# EAGLE schematic base-module-r1 (EAGLE 5.12)

## Sheet 1 of 4
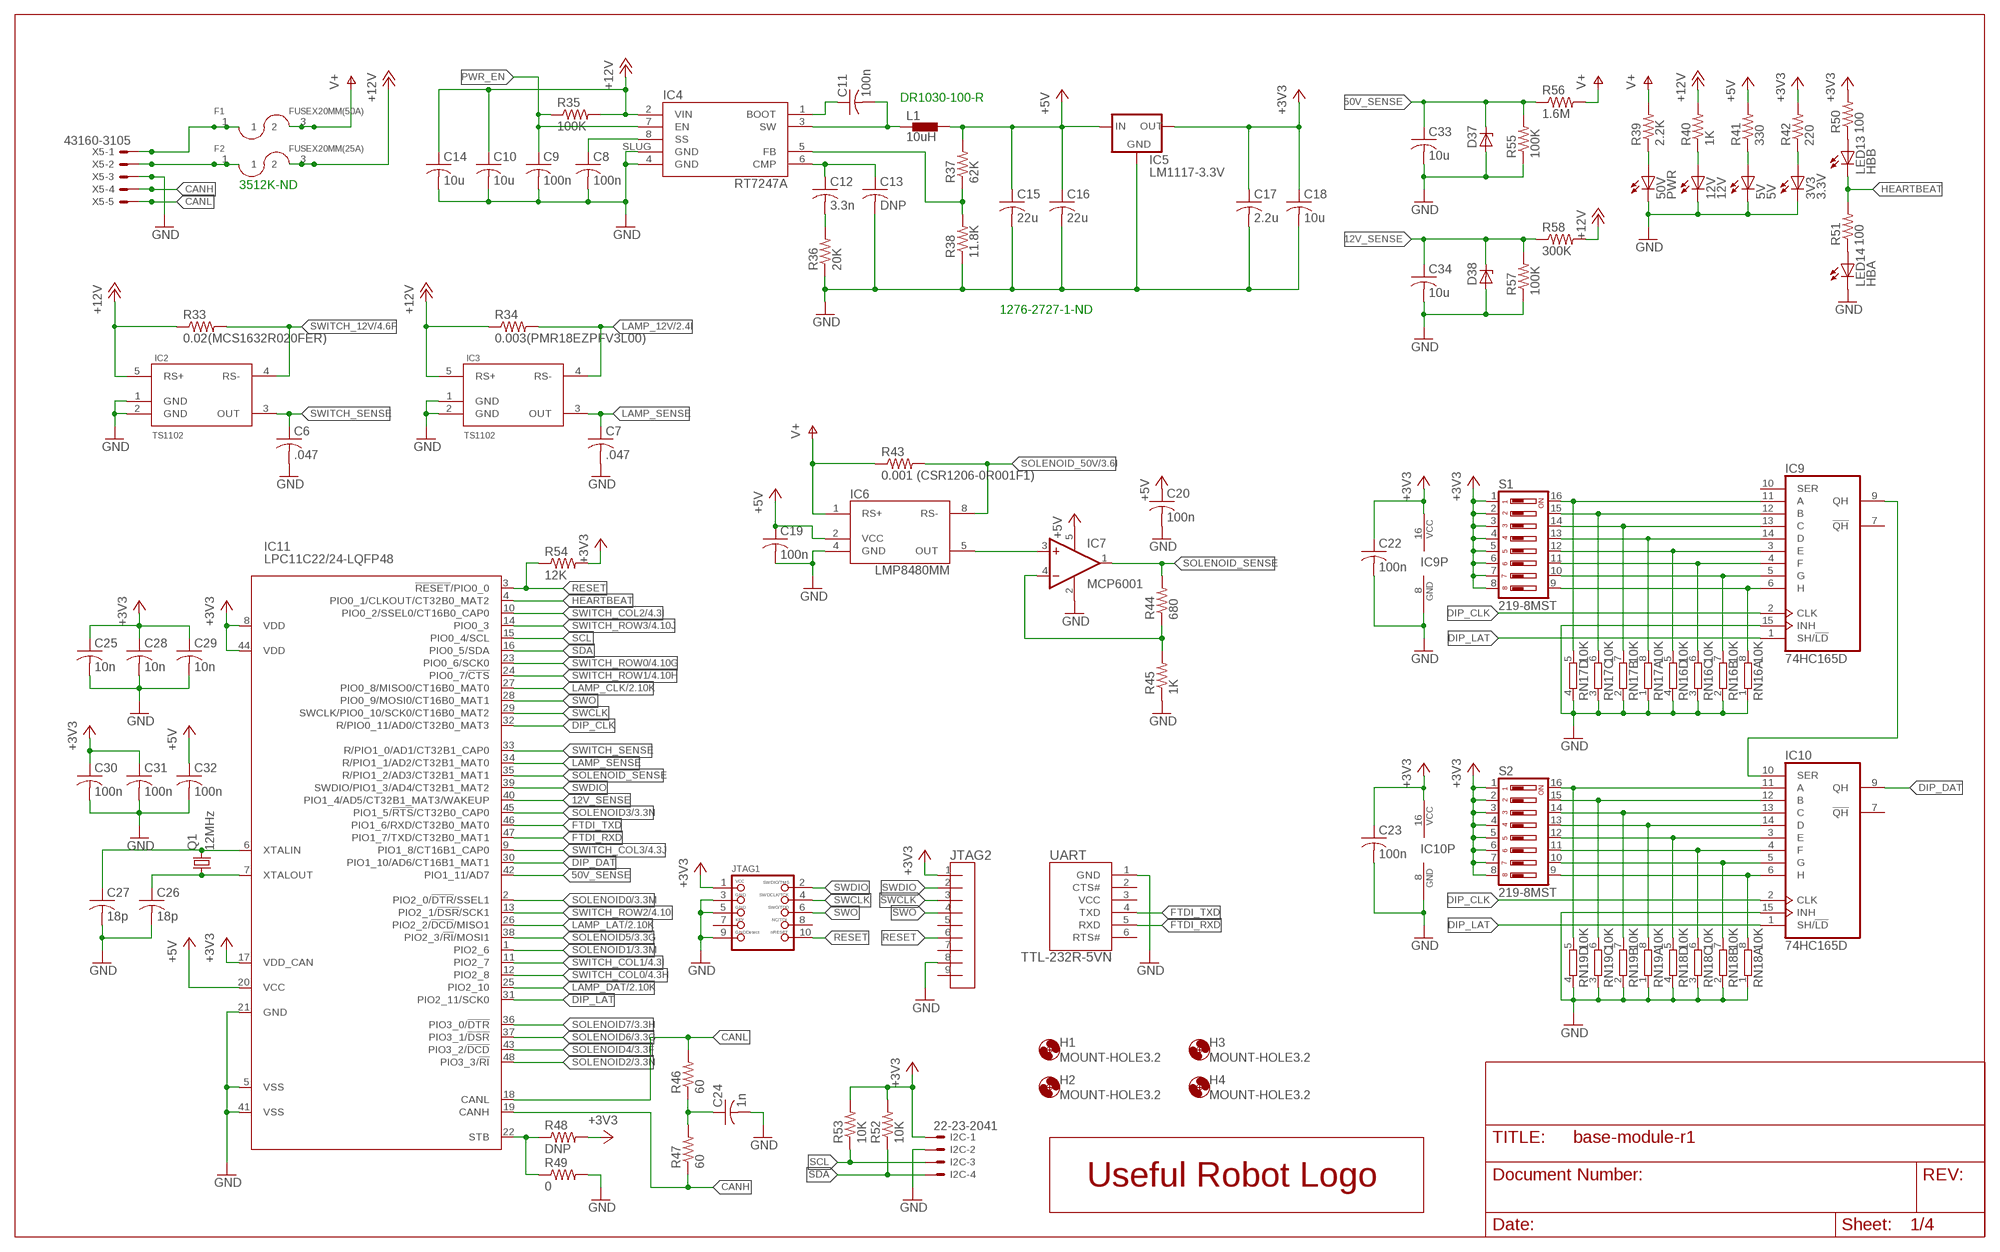
[diagram p0: schematic, sheet 1]

### Parts
3V3  3.3V  LEDCHIP-LED0805  [CHIP-LED0805]
5V  5V  LEDCHIP-LED0805  [CHIP-LED0805]
12V  12V  LEDCHIP-LED0805  [CHIP-LED0805]
50V  PWR  LEDCHIP-LED0805  [CHIP-LED0805]
C6  .047  C-USC0603  [C0603]
C7  .047  C-USC0603  [C0603]
C8  100n  C-USC0805  [C0805]
C9  100n  C-USC0805  [C0805]
C10  10u  C-USC1206  [C1206]
C11  100n  C-USC0805  [C0805]
C12  3.3n  C-USC0805  [C0805]
C13  DNP  C-USC0805  [C0805]
C14  10u  C-USC1206  [C1206]
C15  22u  C-USC1206  [C1206]
C16  22u  C-USC1206  [C1206]
C17  2.2u  C-USC0805  [C0805]
C18  10u  C-USC1206  [C1206]
C19  100n  C-USC0603  [C0603]
C20  100n  C-USC0603  [C0603]
C22  100n  C-USC0603  [C0603]
C23  100n  C-USC0603  [C0603]
C24  1n  C-USC0603  [C0603]
C25  10n  C-USC0603  [C0603]
C26  18p  C-USC0603  [C0603]
C27  18p  C-USC0603  [C0603]
C28  10n  C-USC0603  [C0603]
C29  10n  C-USC0603  [C0603]
C30  100n  C-USC0603  [C0603]
C31  100n  C-USC0603  [C0603]
C32  100n  C-USC0603  [C0603]
C33  10u  C-USC1206  [C1206]
C34  10u  C-USC1206  [C1206]
D37  ZENER-DIODESOD80C  [SOD80C]
D38  ZENER-DIODESOD80C  [SOD80C]
F1  FUSEX20MM(50A)  FUSEX20MM  [FUSE_5MM]
F2  FUSEX20MM(25A)  FUSEX20MM  [FUSE_5MM]
H1  MOUNT-HOLE3.2  [3,2]
H2  MOUNT-HOLE3.2  [3,2]
H3  MOUNT-HOLE3.2  [3,2]
H4  MOUNT-HOLE3.2  [3,2]
I2C  22-23-2041  [22-23-2041]
IC2  TS1102  MAX9938FEUK  [SOT23-5L]
IC3  TS1102  MAX9938FEUK  [SOT23-5L]
IC4  RT7247A  [SO08]
IC5  LM1117-3.3V  LM1117  [SOT223]
IC6  LMP8480MM  [MSOP-8]
IC7  MCP6001  MCP601OT  [SOT23-5]
IC9  74HC165D  74LS165D  [SO16]
IC10  74HC165D  74LS165D  [SO16]
IC11  LPC11C22/24-LQFP48  [LQFP48]
JTAG1  JTAG-CORTEXM3  [2X05_1.27MM_SMT]
JTAG2  M09-100MIL  [100MIL-9]
L1  10uH  DR1030  [DR1030]
LED13  HBB  LEDCHIP-LED0805  [CHIP-LED0805]
LED14  HBA  LEDCHIP-LED0805  [CHIP-LED0805]
Q1  12MHz  CRYSTALHC49UP  [HC49UP]
R33  0.02(MCS1632R020FER)  R-US_M3516  [M3516]
R34  0.003(PMR18EZPFV3L00)  R-US_M3516  [M3516]
R35  100K  R-US_R0805  [R0805]
R36  20K  R-US_R0805  [R0805]
R37  62K  R-US_R0805  [R0805]
R38  11.8K  R-US_R0805  [R0805]
R39  2.2K  R-US_R0805  [R0805]
R40  1K  R-US_R0603  [R0603]
R41  330  R-US_R0603  [R0603]
R42  220  R-US_R0603  [R0603]
R43  0.001 (CSR1206-0R001F1)  R-US_M3516  [M3516]
R44  680  R-US_R0603  [R0603]
R45  1K  R-US_R0603  [R0603]
R46  60  R-US_R0603  [R0603]
R47  60  R-US_R0603  [R0603]
R48  DNP  R-US_R0603  [R0603]
R49  0  R-US_R0603  [R0603]
R50  100  R-US_R0603  [R0603]
R51  100  R-US_R0603  [R0603]
R52  10K  R-US_R0603  [R0603]
R53  10K  R-US_R0603  [R0603]
R54  12K  R-US_R0603  [R0603]
R55  100K  R-US_R0603  [R0603]
R56  1.6M  R-US_R0603  [R0603]
R57  100K  R-US_R0603  [R0603]
R58  300K  R-US_R0603  [R0603]
RN16  10K  4R-NEXBS8V  [EXBS8V]
RN17  10K  4R-NEXBS8V  [EXBS8V]
RN18  10K  4R-NEXBS8V  [EXBS8V]
RN19  10K  4R-NEXBS8V  [EXBS8V]
S1  219-8MST  DS08  [DS-08]
S2  219-8MST  DS08  [DS-08]
U$3  UR_LOGO10  [UR_LOGO_10X10]
UART  TTL-232R-5VN  [USBCABLE-0.100-NOLBL]
X5  43160-3105  [43160-XX05]

### Nets
12V_SENSE: C34.1 D38.C IC11.40(PIO1_4/AD5/CT32B1_MAT3/WAKEUP) R57.2 R58.1
50V_SENSE: C33.1 D37.C IC11.42(PIO1_11/AD7) R55.2 R56.1
+3V3: C17.1 C18.1 C22.1 C23.1 C25.1 C28.1 C29.1 C30.1 C31.1 I2C.1 IC5.2(OUT) IC9.16(VCC) IC10.16(VCC) IC11.8(VDD) IC11.17(VDD_CAN) IC11.44(VDD) JTAG1.1 JTAG2.1 R42.2 R48.2 R50.2 R52.2 R53.2 R54.2 S1.1 S1.2 S1.3 S1.4 S1.5 S1.6 S1.7 S1.8 S2.1 S2.2 S2.3 S2.4 S2.5 S2.6 S2.7 S2.8 ; also sheet 2,3,4
+5V: C15.1 C16.1 C19.1 C20.1 C32.1 IC5.3(IN) IC6.2(VCC) IC7.5(V+) IC11.20(VCC) L1.2 R37.2 R41.2
+12V: C10.1 C14.1 F2.3 F2.4(2B) IC2.5(RS+) IC3.5(RS+) IC4.2(VIN) R33.1 R34.1 R35.2 R40.2 R58.2
CANH: IC11.19(CANH) R47.1 X5.4@1(-4:S) X5.4@2(-4:S)
CANL: IC11.18(CANL) R46.2 X5.5@1(-5:S) X5.5@2(-5:S)
DIP_CLK: IC9.2(CLK) IC10.2(CLK) IC11.32(R/PIO0_11/AD0/CT32B0_MAT3)
DIP_DAT: IC10.9(QH) IC11.30(PIO1_10/AD6/CT16B1_MAT1)
DIP_LAT: IC9.1(SH/!LD) IC10.1(SH/!LD) IC11.31(PIO2_11/SCK0)
FTDI_RXD: IC11.47(PIO1_7/TXD/CT32B0_MAT1) UART.5(RXD)
FTDI_TXD: IC11.46(PIO1_6/RXD/CT32B0_MAT0) UART.4(TXD)
GND: 3V3.C 5V.C 12V.C 50V.C C6.2 C7.2 C8.2 C9.2 C10.2 C13.2 C14.2 C15.2 C16.2 C17.2 C18.2 C19.2 C20.2 C22.2 C23.2 C24.2 C25.2 C26.2 C27.2 C28.2 C29.2 C30.2 C31.2 C32.2 C33.2 C34.2 D37.A D38.A I2C.2 IC2.1(GND) IC2.2(GND) IC3.1(GND) IC3.2(GND) IC4.4(GND) IC4.SLUG(GND) IC5.1(GND) IC6.4(GND) IC7.2(V-) IC9.8(GND) IC9.15(INH) IC10.8(GND) IC10.15(INH) IC11.5(VSS) IC11.21(GND) IC11.41(VSS) JTAG1.3 JTAG1.5 JTAG1.9 JTAG2.8 LED14.C R36.1 R38.1 R45.1 R49.2 R55.1 R57.1 RN16.1 RN16.2 RN16.3 RN16.4 RN17.1 RN17.2 RN17.3 RN17.4 RN18.1 RN18.2 RN18.3 RN18.4 RN19.1 RN19.2 RN19.3 RN19.4 UART.1(GND) X5.3@1(-3:S) X5.3@2(-3:S) ; also sheet 2,3,4
HEARTBEAT: IC11.4(PIO0_1/CLKOUT/CT32B0_MAT2) LED13.C R51.2
LAMP_12V: IC3.4(RS-) R34.2 ; also sheet 2
LAMP_CLK: IC11.27(PIO0_8/MISO0/CT16B0_MAT0) ; also sheet 2
LAMP_DAT: IC11.25(PIO2_10) ; also sheet 2
LAMP_LAT: IC11.26(PIO2_2/!DCD!/MISO1) ; also sheet 2
LAMP_SENSE: C7.1 IC3.3(OUT) IC11.34(R/PIO1_1/AD2/CT32B1_MAT0)
N$69: F2.1 F2.2(1B) X5.2@1(-2:S) X5.2@2(-2:S)
N$90 [HV]: F1.1 F1.2(1B) X5.1@1(-1:S) X5.1@2(-1:S)
N$91: 12V.A R40.1
N$92: C8.1 IC4.8(SS)
N$93: IC7.4(-IN) R44.1 R45.2
N$94: 50V.A R39.1
N$95: C11.1 IC4.1(BOOT)
N$96: C11.2 IC4.3(SW) L1.1
N$97: C12.1 C13.1 IC4.6(CMP)
N$98: C12.2 R36.2
N$99: IC4.5(FB) R37.1 R38.2
N$100: 5V.A R41.1
N$101: 3V3.A R42.1
N$102: IC6.5(OUT) IC7.3(+IN)
N$103: IC11.22(STB) R48.1 R49.1
N$104: IC9.6(H) RN16.8 S1.9
N$105: IC9.5(G) RN16.7 S1.10
N$106: IC9.4(F) RN16.6 S1.11
N$107: IC9.3(E) RN16.5 S1.12
N$108: IC9.14(D) RN17.8 S1.13
N$109: IC9.13(C) RN17.7 S1.14
N$110: IC9.12(B) RN17.6 S1.15
N$111: IC9.11(A) RN17.5 S1.16
N$112: IC10.6(H) RN18.8 S2.9
N$113: IC10.5(G) RN18.7 S2.10
N$114: IC10.4(F) RN18.6 S2.11
N$115: IC10.3(E) RN18.5 S2.12
N$116: IC10.14(D) RN19.8 S2.13
N$117: IC10.13(C) RN19.7 S2.14
N$118: IC10.12(B) RN19.6 S2.15
N$119: IC10.11(A) RN19.5 S2.16
N$120: IC9.9(QH) IC10.10(SER)
N$121: C26.1 IC11.7(XTALOUT) Q1.1
N$122: C24.1 R46.1 R47.2
N$123: C27.1 IC11.6(XTALIN) Q1.2
N$126: LED13.A R50.1
N$127: LED14.A R51.1
PWR_EN: C9.1 IC4.7(EN) R35.1
RESET: IC11.3(!RESET!/PIO0_0) JTAG1.10 JTAG2.6 R54.1
SCL: I2C.3 IC11.15(PIO0_4/SCL) R53.1
SDA: I2C.4 IC11.16(PIO0_5/SDA) R52.1
SOLENOID0: IC11.2(PIO2_0/!DTR!/SSEL1) ; also sheet 3
SOLENOID1: IC11.1(PIO2_6) ; also sheet 3
SOLENOID2: IC11.48(PIO3_3/!RI!) ; also sheet 3
SOLENOID3: IC11.45(PIO1_5/!RTS!/CT32B0_CAP0) ; also sheet 3
SOLENOID4: IC11.43(PIO3_2/!DCD!) ; also sheet 3
SOLENOID5: IC11.38(PIO2_3/!RI!/MOSI1) ; also sheet 3
SOLENOID6: IC11.37(PIO3_1/!DSR!) ; also sheet 3
SOLENOID7: IC11.36(PIO3_0/!DTR!) ; also sheet 3
SOLENOID_50V [HV]: IC6.8(RS-) R43.2 ; also sheet 3
SOLENOID_SENSE: IC7.1(OUT) IC11.35(R/PIO1_2/AD3/CT32B1_MAT1) R44.2
SWCLK: IC11.29(SWCLK/PIO0_10/SCK0/CT16B0_MAT2) JTAG1.4 JTAG2.3
SWDIO: IC11.39(SWDIO/PIO1_3/AD4/CT32B1_MAT2) JTAG1.2 JTAG2.2
SWITCH_12V: IC2.4(RS-) R33.2 ; also sheet 4
SWITCH_COL0: IC11.12(PIO2_8) ; also sheet 4
SWITCH_COL1: IC11.11(PIO2_7) ; also sheet 4
SWITCH_COL2: IC11.10(PIO0_2/SSEL0/CT16B0_CAP0) ; also sheet 4
SWITCH_COL3: IC11.9(PIO1_8/CT16B1_CAP0) ; also sheet 4
SWITCH_ROW0: IC11.23(PIO0_6/SCK0) ; also sheet 4
SWITCH_ROW1: IC11.24(PIO0_7/!CTS!) ; also sheet 4
SWITCH_ROW2: IC11.13(PIO2_1/!DSR!/SCK1) ; also sheet 4
SWITCH_ROW3: IC11.14(PIO0_3) ; also sheet 4
SWITCH_SENSE: C6.1 IC2.3(OUT) IC11.33(R/PIO1_0/AD1/CT32B1_CAP0)
SWO: IC11.28(PIO0_9/MOSI0/CT16B0_MAT1) JTAG1.6 JTAG2.4
V+ [HV]: F1.3 F1.4(2B) IC6.1(RS+) R39.2 R43.1 R56.2
Unconnected: IC9.7(!QH) IC9.10(SER) IC10.7(!QH) JTAG1.7 JTAG1.8 JTAG2.5 JTAG2.7 JTAG2.9 UART.2(CTS#) UART.3(VCC) UART.6(RTS#)

### Notes on the sheet
- DR1030-100-R
- 3512K-ND
- 1276-2727-1-ND

## Sheet 2 of 4
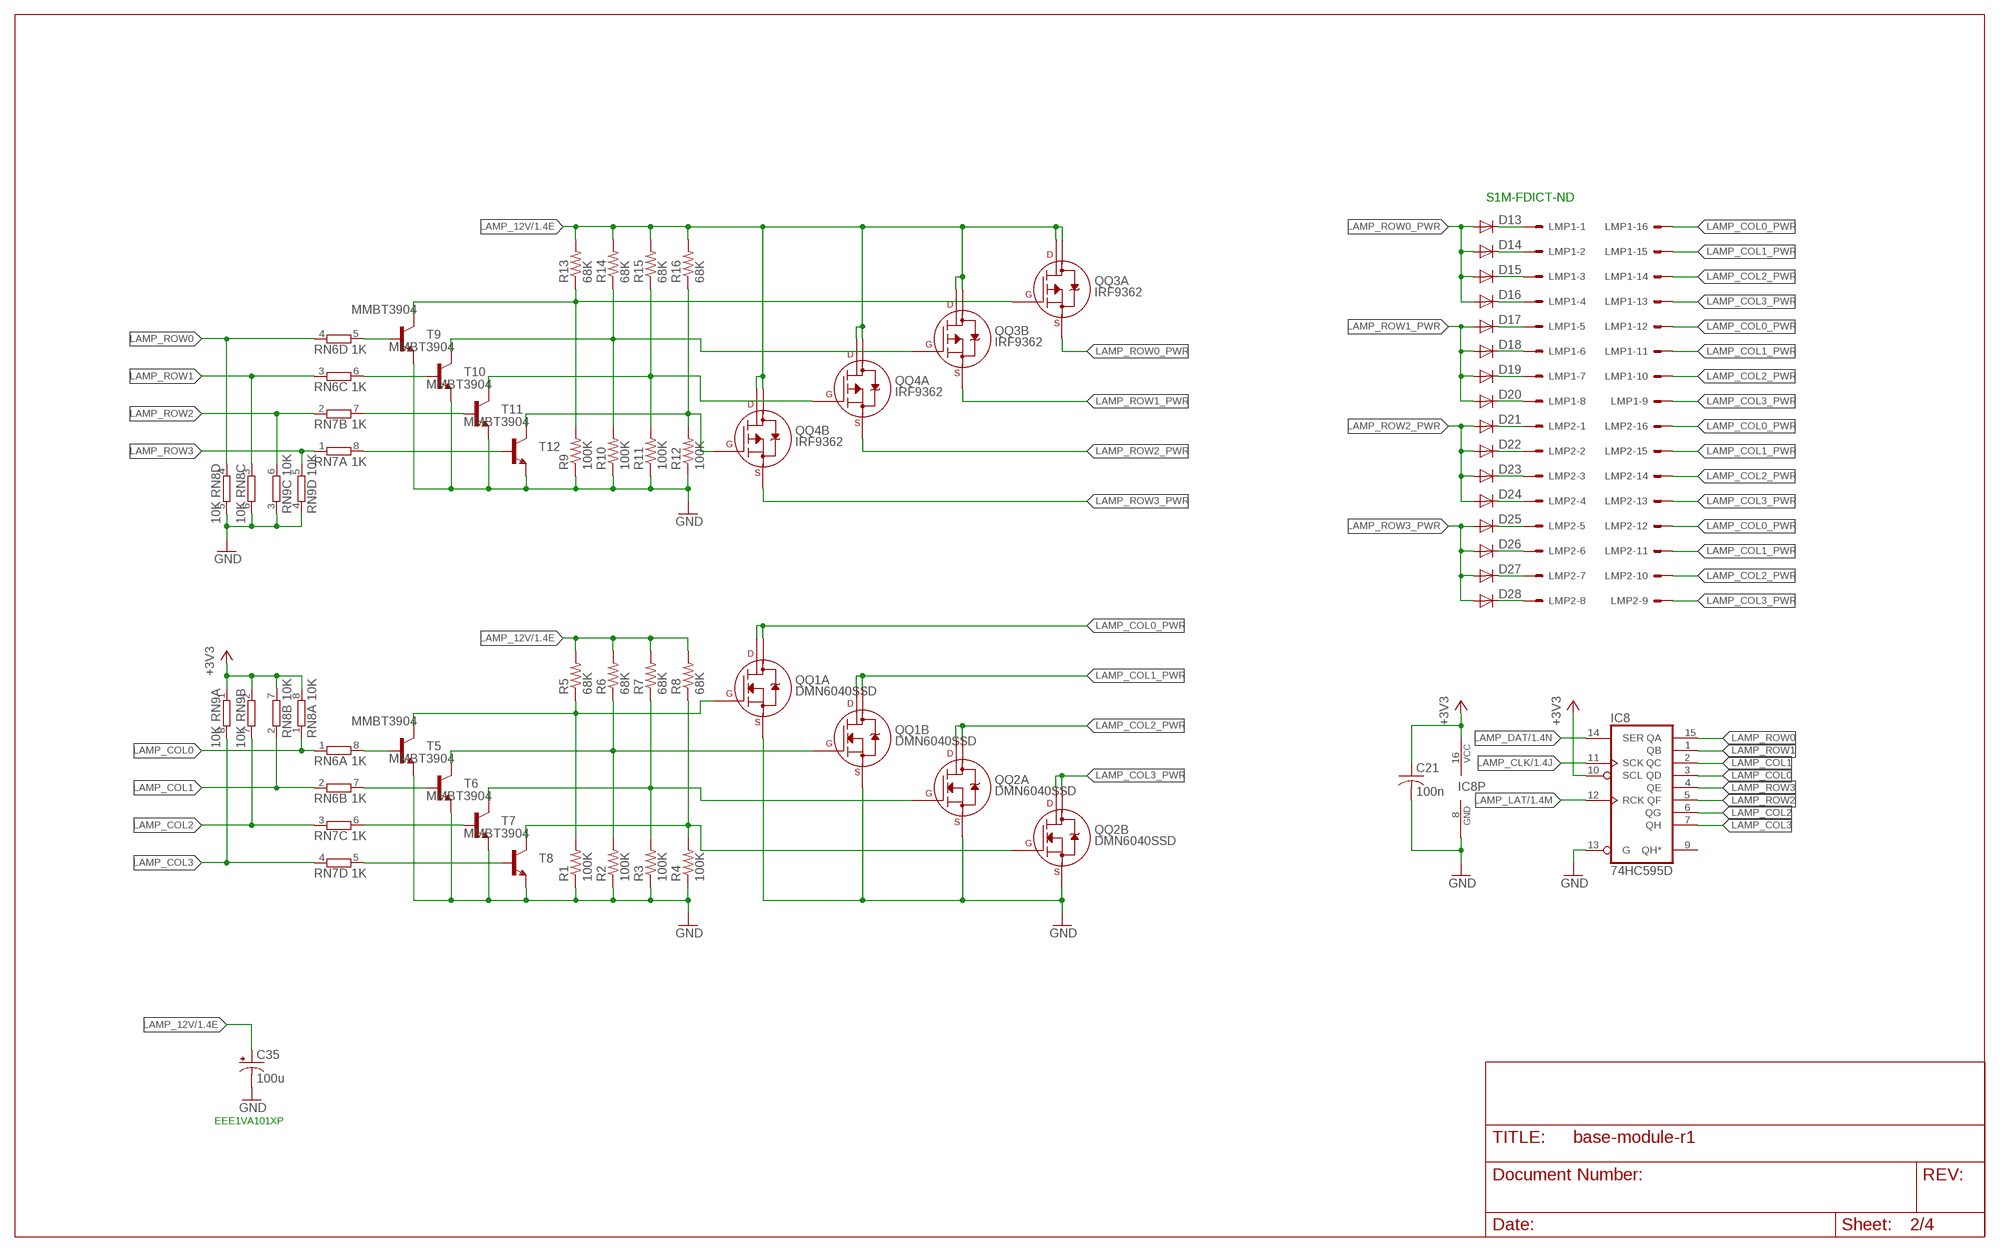
[diagram p1: schematic, sheet 2]

### Parts
C21  100n  C-USC0603  [C0603]
C35  100u  CPOL-USD  [PANASONIC_D]
D13  DIODESMA  [SMA-DIODE]
D14  DIODESMA  [SMA-DIODE]
D15  DIODESMA  [SMA-DIODE]
D16  DIODESMA  [SMA-DIODE]
D17  DIODESMA  [SMA-DIODE]
D18  DIODESMA  [SMA-DIODE]
D19  DIODESMA  [SMA-DIODE]
D20  DIODESMA  [SMA-DIODE]
D21  DIODESMA  [SMA-DIODE]
D22  DIODESMA  [SMA-DIODE]
D23  DIODESMA  [SMA-DIODE]
D24  DIODESMA  [SMA-DIODE]
D25  DIODESMA  [SMA-DIODE]
D26  DIODESMA  [SMA-DIODE]
D27  DIODESMA  [SMA-DIODE]
D28  DIODESMA  [SMA-DIODE]
IC8  74HC595D  74LS595D  [SO16]
LMP1  555X-16V  [5566-16]
LMP2  555X-16V  [5566-16]
QQ1  DMN6040SSD  IRF8910  [SO-8]
QQ2  DMN6040SSD  IRF8910  [SO-8]
QQ3  IRF9362  [SO-8]
QQ4  IRF9362  [SO-8]
R1  100K  R-US_R0603  [R0603]
R2  100K  R-US_R0603  [R0603]
R3  100K  R-US_R0603  [R0603]
R4  100K  R-US_R0603  [R0603]
R5  68K  R-US_R0603  [R0603]
R6  68K  R-US_R0603  [R0603]
R7  68K  R-US_R0603  [R0603]
R8  68K  R-US_R0603  [R0603]
R9  100K  R-US_R0603  [R0603]
R10  100K  R-US_R0603  [R0603]
R11  100K  R-US_R0603  [R0603]
R12  100K  R-US_R0603  [R0603]
R13  68K  R-US_R0603  [R0603]
R14  68K  R-US_R0603  [R0603]
R15  68K  R-US_R0603  [R0603]
R16  68K  R-US_R0603  [R0603]
RN6  1K  4R-NEXBS8V  [EXBS8V]
RN7  1K  4R-NEXBS8V  [EXBS8V]
RN8  10K  4R-NEXBS8V  [EXBS8V]
RN9  10K  4R-NEXBS8V  [EXBS8V]
T5  MMBT3904  MMBT3904LT1-NPN-SOT23-BEC  [SOT23-BEC]
T6  MMBT3904  MMBT3904LT1-NPN-SOT23-BEC  [SOT23-BEC]
T7  MMBT3904  MMBT3904LT1-NPN-SOT23-BEC  [SOT23-BEC]
T8  MMBT3904  MMBT3904LT1-NPN-SOT23-BEC  [SOT23-BEC]
T9  MMBT3904  MMBT3904LT1-NPN-SOT23-BEC  [SOT23-BEC]
T10  MMBT3904  MMBT3904LT1-NPN-SOT23-BEC  [SOT23-BEC]
T11  MMBT3904  MMBT3904LT1-NPN-SOT23-BEC  [SOT23-BEC]
T12  MMBT3904  MMBT3904LT1-NPN-SOT23-BEC  [SOT23-BEC]

### Nets
+3V3: C21.1 IC8.10(SCL) IC8.16(VCC) RN8.7 RN8.8 RN9.1 RN9.2 ; also sheet 1,3,4
GND: C21.2 C35.- IC8.8(GND) IC8.13(G) QQ1.1(A:S) QQ1.3(B:S) QQ2.1(A:S) QQ2.3(B:S) R1.1 R2.1 R3.1 R4.1 R9.1 R10.1 R11.1 R12.1 RN8.5 RN8.6 RN9.3 RN9.4 T5.E T6.E T7.E T8.E T9.E T10.E T11.E T12.E ; also sheet 1,3,4
LAMP_12V: C35.+ QQ3.5(B:D1) QQ3.6(B:D2) QQ3.7(A:D2) QQ3.8(A:D1) QQ4.5(B:D1) QQ4.6(B:D2) QQ4.7(A:D2) QQ4.8(A:D1) R5.2 R6.2 R7.2 R8.2 R13.2 R14.2 R15.2 R16.2 ; also sheet 1
LAMP_CLK: IC8.11(SCK) ; also sheet 1
LAMP_COL0: IC8.3(QD) RN6.1 RN8.1
LAMP_COL0_PWR: LMP1.12 LMP1.16 LMP2.12 LMP2.16 QQ1.7(A:D2) QQ1.8(A:D1)
LAMP_COL1: IC8.2(QC) RN6.2 RN8.2
LAMP_COL1_PWR: LMP1.11 LMP1.15 LMP2.11 LMP2.15 QQ1.5(B:D2) QQ1.6(B:D1)
LAMP_COL2: IC8.6(QG) RN7.3 RN9.7
LAMP_COL2_PWR: LMP1.10 LMP1.14 LMP2.10 LMP2.14 QQ2.7(A:D2) QQ2.8(A:D1)
LAMP_COL3: IC8.7(QH) RN7.4 RN9.8
LAMP_COL3_PWR: LMP1.9 LMP1.13 LMP2.9 LMP2.13 QQ2.5(B:D2) QQ2.6(B:D1)
LAMP_DAT: IC8.14(SER) ; also sheet 1
LAMP_LAT: IC8.12(RCK) ; also sheet 1
LAMP_ROW0: IC8.15(QA) RN6.4 RN8.4
LAMP_ROW0_PWR: D13.A D14.A D15.A D16.A QQ3.1(A:S1)
LAMP_ROW1: IC8.1(QB) RN6.3 RN8.3
LAMP_ROW1_PWR: D17.A D18.A D19.A D20.A QQ3.3(B:S1)
LAMP_ROW2: IC8.5(QF) RN7.2 RN9.6
LAMP_ROW2_PWR: D21.A D22.A D23.A D24.A QQ4.1(A:S1)
LAMP_ROW3: IC8.4(QE) RN7.1 RN9.5
LAMP_ROW3_PWR: D25.A D26.A D27.A D28.A QQ4.3(B:S1)
N$14: RN6.8 T5.B
N$26: RN6.7 T6.B
N$27: RN7.6 T7.B
N$28: QQ1.2(A:G) R1.2 R5.1 T5.C
N$29: QQ1.4(B:G) R2.2 R6.1 T6.C
N$30: QQ2.2(A:G) R3.2 R7.1 T7.C
N$31: QQ2.4(B:G) R4.2 R8.1 T8.C
N$32: RN7.5 T8.B
N$33: QQ3.2(A:G1) R9.2 R13.1 T9.C
N$34: QQ3.4(B:G1) R10.2 R14.1 T10.C
N$35: QQ4.2(A:G1) R11.2 R15.1 T11.C
N$36: QQ4.4(B:G1) R12.2 R16.1 T12.C
N$37: RN6.5 T9.B
N$38: RN6.6 T10.B
N$39: RN7.7 T11.B
N$40: RN7.8 T12.B
N$41: D13.C LMP1.1
N$42: D14.C LMP1.2
N$43: D15.C LMP1.3
N$44: D16.C LMP1.4
N$45: D17.C LMP1.5
N$46: D18.C LMP1.6
N$47: D19.C LMP1.7
N$48: D20.C LMP1.8
N$51: D21.C LMP2.1
N$52: D22.C LMP2.2
N$53: D23.C LMP2.3
N$54: D24.C LMP2.4
N$55: D25.C LMP2.5
N$56: D26.C LMP2.6
N$57: D27.C LMP2.7
N$58: D28.C LMP2.8
Unconnected: IC8.9(QH*)

### Notes on the sheet
- S1M-FDICT-ND
- EEE1VA101XP

## Sheet 3 of 4
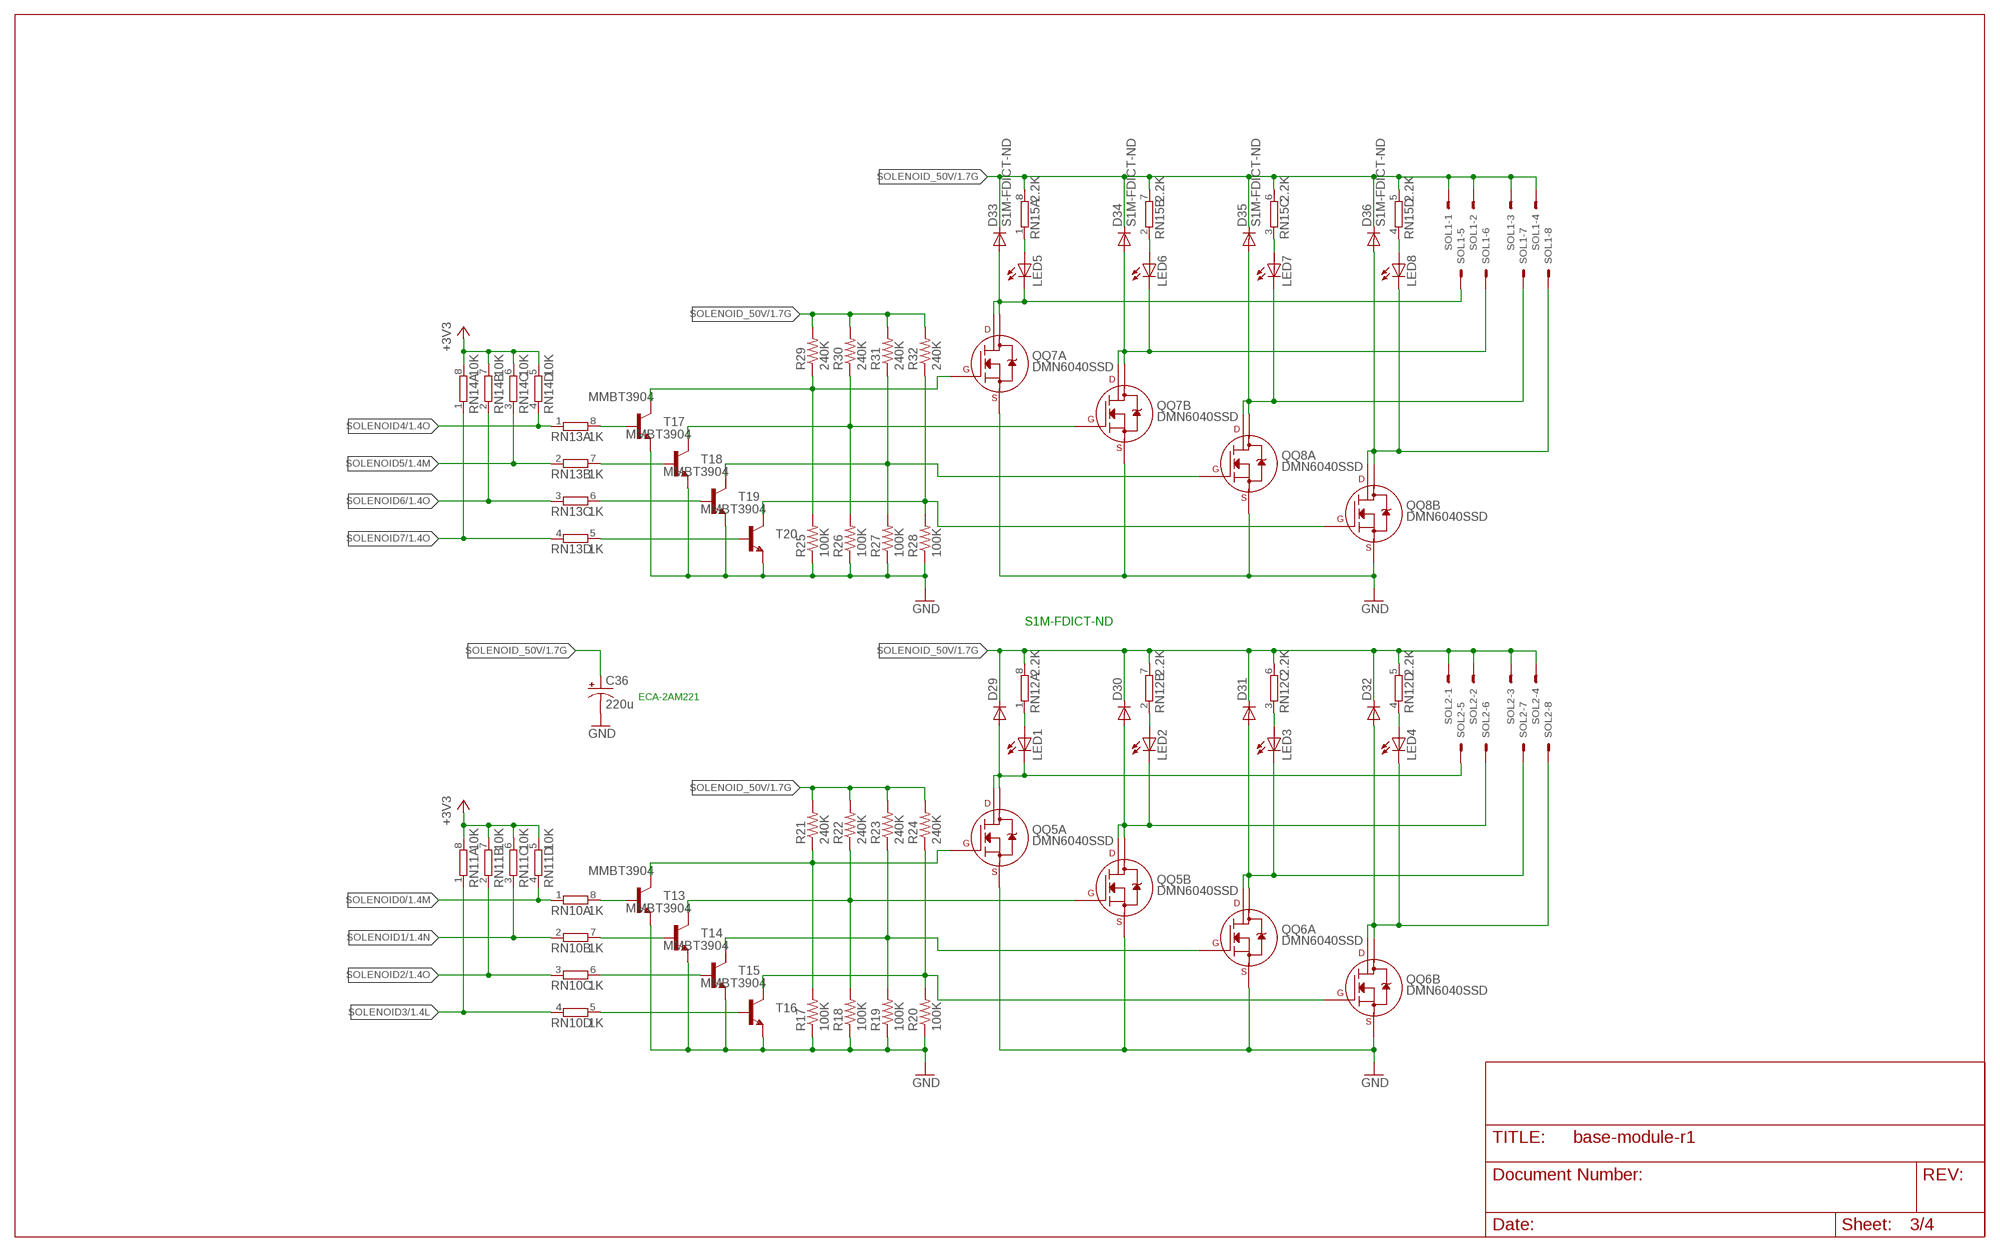
[diagram p2: schematic, sheet 3]

### Parts
C36  220u  CPOL-USE5-13  [E5-13]
D29  DIODESMA  [SMA-DIODE]
D30  DIODESMA  [SMA-DIODE]
D31  DIODESMA  [SMA-DIODE]
D32  DIODESMA  [SMA-DIODE]
D33  S1M-FDICT-ND  DIODESMA  [SMA-DIODE]
D34  S1M-FDICT-ND  DIODESMA  [SMA-DIODE]
D35  S1M-FDICT-ND  DIODESMA  [SMA-DIODE]
D36  S1M-FDICT-ND  DIODESMA  [SMA-DIODE]
LED1  LEDCHIP-LED0805  [CHIP-LED0805]
LED2  LEDCHIP-LED0805  [CHIP-LED0805]
LED3  LEDCHIP-LED0805  [CHIP-LED0805]
LED4  LEDCHIP-LED0805  [CHIP-LED0805]
LED5  LEDCHIP-LED0805  [CHIP-LED0805]
LED6  LEDCHIP-LED0805  [CHIP-LED0805]
LED7  LEDCHIP-LED0805  [CHIP-LED0805]
LED8  LEDCHIP-LED0805  [CHIP-LED0805]
QQ5  DMN6040SSD  IRF8910  [SO-8]
QQ6  DMN6040SSD  IRF8910  [SO-8]
QQ7  DMN6040SSD  IRF8910  [SO-8]
QQ8  DMN6040SSD  IRF8910  [SO-8]
R17  100K  R-US_R0805  [R0805]
R18  100K  R-US_R0805  [R0805]
R19  100K  R-US_R0805  [R0805]
R20  100K  R-US_R0805  [R0805]
R21  240K  R-US_R0805  [R0805]
R22  240K  R-US_R0805  [R0805]
R23  240K  R-US_R0805  [R0805]
R24  240K  R-US_R0805  [R0805]
R25  100K  R-US_R0805  [R0805]
R26  100K  R-US_R0805  [R0805]
R27  100K  R-US_R0805  [R0805]
R28  100K  R-US_R0805  [R0805]
R29  240K  R-US_R0805  [R0805]
R30  240K  R-US_R0805  [R0805]
R31  240K  R-US_R0805  [R0805]
R32  240K  R-US_R0805  [R0805]
RN10  1K  4R-NEXBS8V  [EXBS8V]
RN11  10K  4R-NEXBS8V  [EXBS8V]
RN12  2.2K  4R-NEXBS8V  [EXBS8V]
RN13  1K  4R-NEXBS8V  [EXBS8V]
RN14  10K  4R-NEXBS8V  [EXBS8V]
RN15  2.2K  4R-NEXBS8V  [EXBS8V]
SOL1  555X-8V  [5566-8]
SOL2  555X-8V  [5566-8]
T13  MMBT3904  MMBT3904LT1-NPN-SOT23-BEC  [SOT23-BEC]
T14  MMBT3904  MMBT3904LT1-NPN-SOT23-BEC  [SOT23-BEC]
T15  MMBT3904  MMBT3904LT1-NPN-SOT23-BEC  [SOT23-BEC]
T16  MMBT3904  MMBT3904LT1-NPN-SOT23-BEC  [SOT23-BEC]
T17  MMBT3904  MMBT3904LT1-NPN-SOT23-BEC  [SOT23-BEC]
T18  MMBT3904  MMBT3904LT1-NPN-SOT23-BEC  [SOT23-BEC]
T19  MMBT3904  MMBT3904LT1-NPN-SOT23-BEC  [SOT23-BEC]
T20  MMBT3904  MMBT3904LT1-NPN-SOT23-BEC  [SOT23-BEC]

### Nets
+3V3: RN11.5 RN11.6 RN11.7 RN11.8 RN14.5 RN14.6 RN14.7 RN14.8 ; also sheet 1,2,4
GND: C36.- QQ5.1(A:S) QQ5.3(B:S) QQ6.1(A:S) QQ6.3(B:S) QQ7.1(A:S) QQ7.3(B:S) QQ8.1(A:S) QQ8.3(B:S) R17.1 R18.1 R19.1 R20.1 R25.1 R26.1 R27.1 R28.1 T13.E T14.E T15.E T16.E T17.E T18.E T19.E T20.E ; also sheet 1,2,4
N$49: QQ5.2(A:G) R17.2 R21.1 T13.C
N$50: QQ5.4(B:G) R18.2 R22.1 T14.C
N$59: QQ6.2(A:G) R19.2 R23.1 T15.C
N$60: QQ6.4(B:G) R20.2 R24.1 T16.C
N$61: RN10.8 T13.B
N$62: RN10.7 T14.B
N$63: RN10.6 T15.B
N$64: RN10.5 T16.B
N$65: D29.A LED1.C QQ5.7(A:D2) QQ5.8(A:D1) SOL2.5
N$66: D30.A LED2.C QQ5.5(B:D2) QQ5.6(B:D1) SOL2.6
N$67: D31.A LED3.C QQ6.7(A:D2) QQ6.8(A:D1) SOL2.7
N$68: D32.A LED4.C QQ6.5(B:D2) QQ6.6(B:D1) SOL2.8
N$70: LED4.A RN12.4
N$71: LED3.A RN12.3
N$72: LED2.A RN12.2
N$73: LED1.A RN12.1
N$74: QQ7.2(A:G) R25.2 R29.1 T17.C
N$75: QQ7.4(B:G) R26.2 R30.1 T18.C
N$76: QQ8.2(A:G) R27.2 R31.1 T19.C
N$77: QQ8.4(B:G) R28.2 R32.1 T20.C
N$78: RN13.8 T17.B
N$79: RN13.7 T18.B
N$80: RN13.6 T19.B
N$81: RN13.5 T20.B
N$82: D33.A LED5.C QQ7.7(A:D2) QQ7.8(A:D1) SOL1.5
N$83: D34.A LED6.C QQ7.5(B:D2) QQ7.6(B:D1) SOL1.6
N$84: D35.A LED7.C QQ8.7(A:D2) QQ8.8(A:D1) SOL1.7
N$85: D36.A LED8.C QQ8.5(B:D2) QQ8.6(B:D1) SOL1.8
N$86: LED8.A RN15.4
N$87: LED7.A RN15.3
N$88: LED6.A RN15.2
N$89: LED5.A RN15.1
SOLENOID0: RN10.1 RN11.4 ; also sheet 1
SOLENOID1: RN10.2 RN11.3 ; also sheet 1
SOLENOID2: RN10.3 RN11.2 ; also sheet 1
SOLENOID3: RN10.4 RN11.1 ; also sheet 1
SOLENOID4: RN13.1 RN14.4 ; also sheet 1
SOLENOID5: RN13.2 RN14.3 ; also sheet 1
SOLENOID6: RN13.3 RN14.2 ; also sheet 1
SOLENOID7: RN13.4 RN14.1 ; also sheet 1
SOLENOID_50V [HV]: C36.+ D29.C D30.C D31.C D32.C D33.C D34.C D35.C D36.C R21.2 R22.2 R23.2 R24.2 R29.2 R30.2 R31.2 R32.2 RN12.5 RN12.6 RN12.7 RN12.8 RN15.5 RN15.6 RN15.7 RN15.8 SOL1.1 SOL1.2 SOL1.3 SOL1.4 SOL2.1 SOL2.2 SOL2.3 SOL2.4 ; also sheet 1

### Notes on the sheet
- S1M-FDICT-ND
- ECA-2AM221

## Sheet 4 of 4
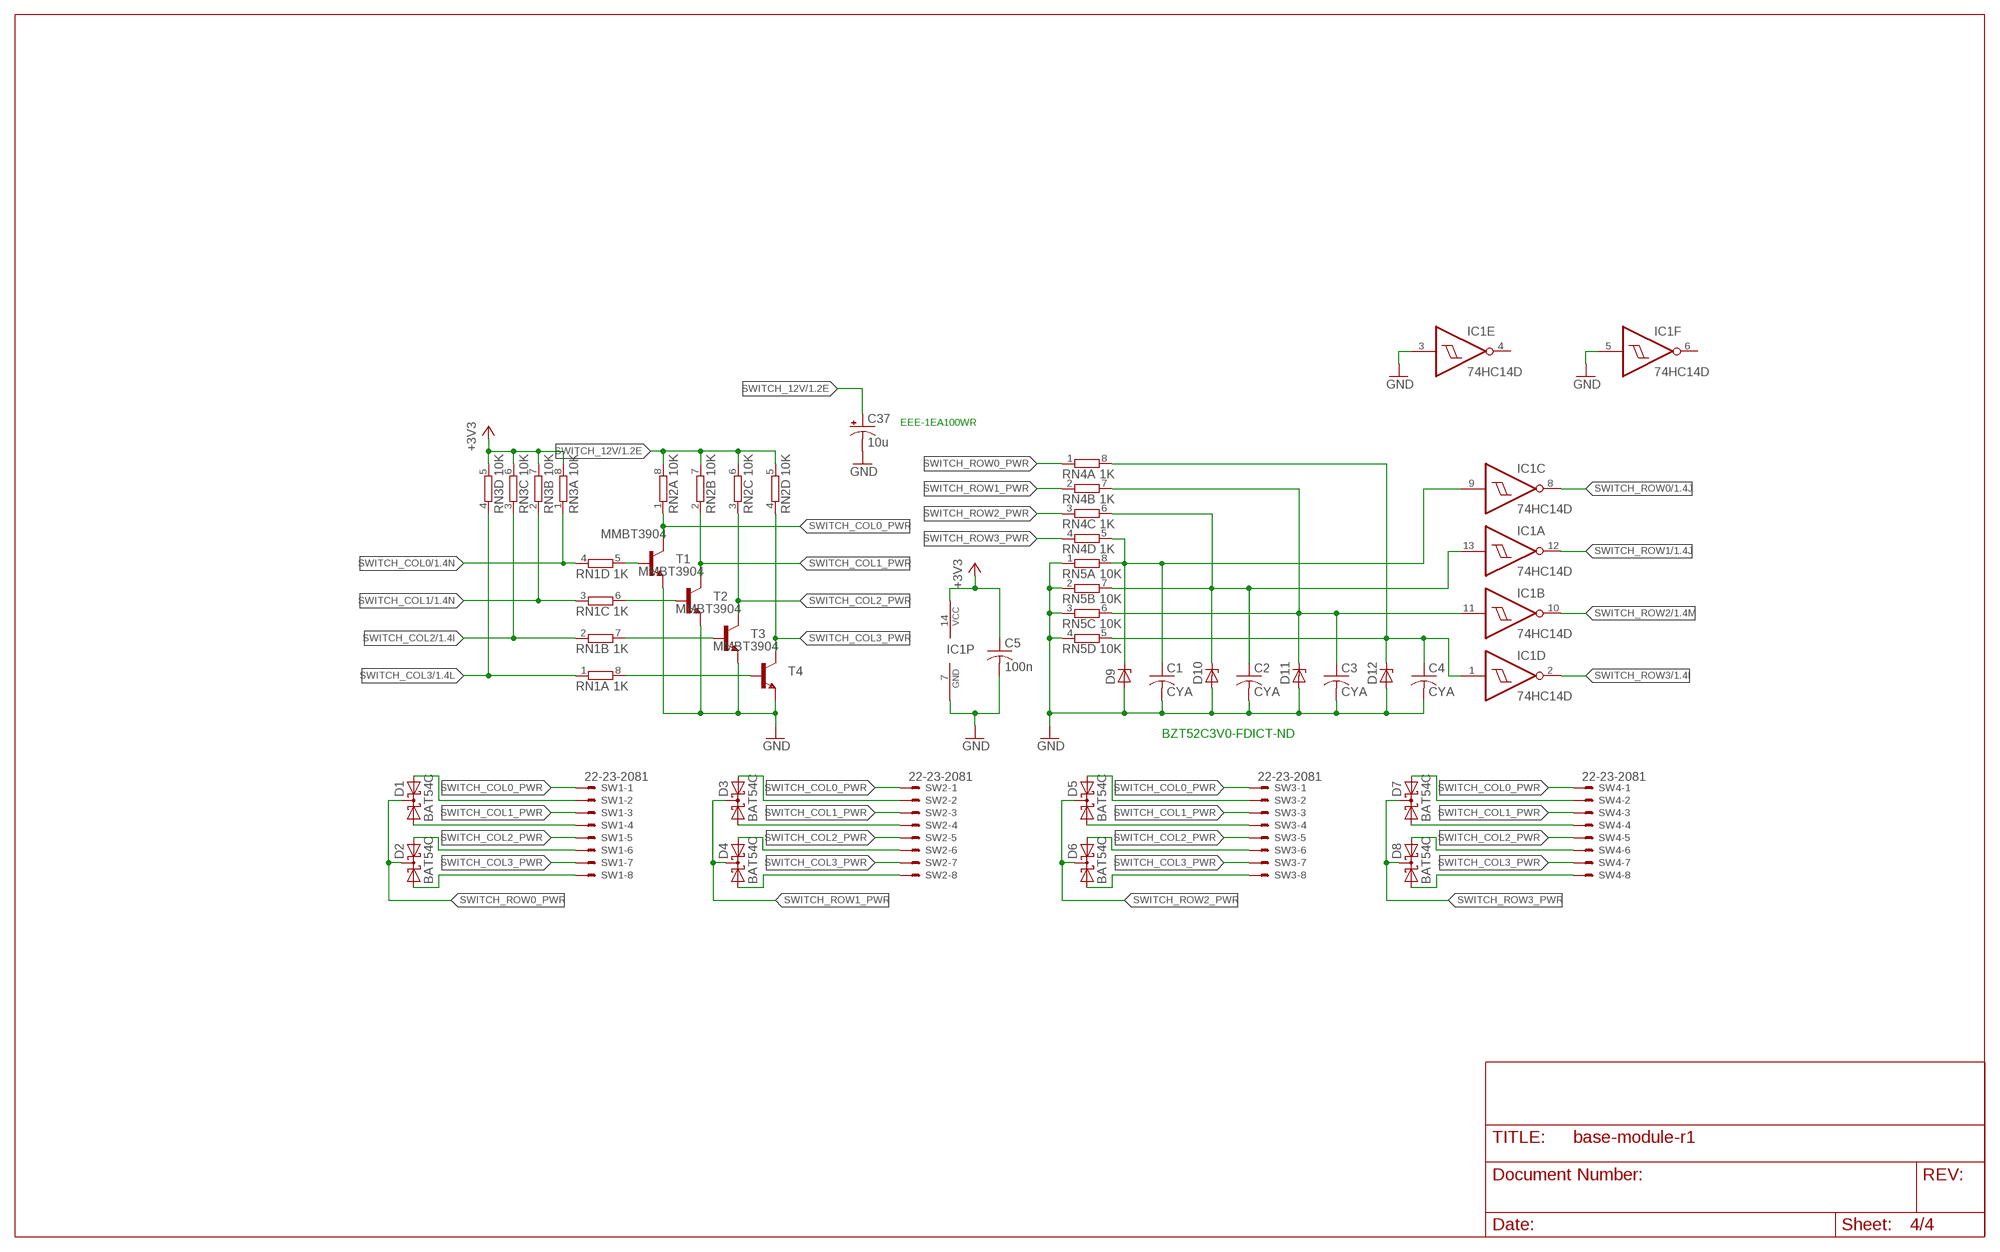
[diagram p3: schematic, sheet 4]

### Parts
C1  CYA  C-USC0603  [C0603]
C2  CYA  C-USC0603  [C0603]
C3  CYA  C-USC0603  [C0603]
C4  CYA  C-USC0603  [C0603]
C5  100n  C-USC0603  [C0603]
C37  10u  CPOL-USB  [PANASONIC_B]
D1  BAT54C  [SOT23]
D2  BAT54C  [SOT23]
D3  BAT54C  [SOT23]
D4  BAT54C  [SOT23]
D5  BAT54C  [SOT23]
D6  BAT54C  [SOT23]
D7  BAT54C  [SOT23]
D8  BAT54C  [SOT23]
D9  ZENER-DIODESMB  [SMB]
D10  ZENER-DIODESMB  [SMB]
D11  ZENER-DIODESMB  [SMB]
D12  ZENER-DIODESMB  [SMB]
IC1  74HC14D  74LS14D  [SO14]
RN1  1K  4R-NEXBS8V  [EXBS8V]
RN2  10K  4R-NEXBS8V  [EXBS8V]
RN3  10K  4R-NEXBS8V  [EXBS8V]
RN4  1K  4R-NEXBS8V  [EXBS8V]
RN5  10K  4R-NEXBS8V  [EXBS8V]
SW1  22-23-2081  [22-23-2081]
SW2  22-23-2081  [22-23-2081]
SW3  22-23-2081  [22-23-2081]
SW4  22-23-2081  [22-23-2081]
T1  MMBT3904  MMBT3904LT1-NPN-SOT23-BEC  [SOT23-BEC]
T2  MMBT3904  MMBT3904LT1-NPN-SOT23-BEC  [SOT23-BEC]
T3  MMBT3904  MMBT3904LT1-NPN-SOT23-BEC  [SOT23-BEC]
T4  MMBT3904  MMBT3904LT1-NPN-SOT23-BEC  [SOT23-BEC]

### Nets
+3V3: C5.1 IC1.14(P:VCC) RN3.5 RN3.6 RN3.7 RN3.8 ; also sheet 1,2,3
GND: C1.2 C2.2 C3.2 C4.2 C5.2 C37.- D9.A D10.A D11.A D12.A IC1.3(E:I) IC1.5(F:I) IC1.7(P:GND) RN5.1 RN5.2 RN5.3 RN5.4 T1.E T2.E T3.E T4.E ; also sheet 1,2,3
N$1: D2.2(A2) SW1.6
N$2: RN1.8 T4.B
N$3: RN1.7 T3.B
N$4: RN1.6 T2.B
N$5: RN1.5 T1.B
N$6: D1.1(A1) SW1.4
N$7: D1.2(A2) SW1.2
N$8: D2.1(A1) SW1.8
N$9: C1.1 D9.C IC1.9(C:I) RN4.5 RN5.8
N$10: D4.2(A2) SW2.6
N$11: D3.1(A1) SW2.4
N$12: D3.2(A2) SW2.2
N$13: D4.1(A1) SW2.8
N$15: D6.2(A2) SW3.6
N$16: D5.1(A1) SW3.4
N$17: D5.2(A2) SW3.2
N$18: D6.1(A1) SW3.8
N$19: C2.1 D10.C IC1.13(A:I) RN4.6 RN5.7
N$20: D8.2(A2) SW4.6
N$21: D7.1(A1) SW4.4
N$22: D7.2(A2) SW4.2
N$23: D8.1(A1) SW4.8
N$24: C3.1 D11.C IC1.11(B:I) RN4.7 RN5.6
N$25: C4.1 D12.C IC1.1(D:I) RN4.8 RN5.5
SWITCH_12V: C37.+ RN2.5 RN2.6 RN2.7 RN2.8 ; also sheet 1
SWITCH_COL0: RN1.4 RN3.1 ; also sheet 1
SWITCH_COL0_PWR: RN2.1 SW1.1 SW2.1 SW3.1 SW4.1 T1.C
SWITCH_COL1: RN1.3 RN3.2 ; also sheet 1
SWITCH_COL1_PWR: RN2.2 SW1.3 SW2.3 SW3.3 SW4.3 T2.C
SWITCH_COL2: RN1.2 RN3.3 ; also sheet 1
SWITCH_COL2_PWR: RN2.3 SW1.5 SW2.5 SW3.5 SW4.5 T3.C
SWITCH_COL3: RN1.1 RN3.4 ; also sheet 1
SWITCH_COL3_PWR: RN2.4 SW1.7 SW2.7 SW3.7 SW4.7 T4.C
SWITCH_ROW0: IC1.8(C:O) ; also sheet 1
SWITCH_ROW0_PWR: D1.3(CC) D2.3(CC) RN4.1
SWITCH_ROW1: IC1.12(A:O) ; also sheet 1
SWITCH_ROW1_PWR: D3.3(CC) D4.3(CC) RN4.2
SWITCH_ROW2: IC1.10(B:O) ; also sheet 1
SWITCH_ROW2_PWR: D5.3(CC) D6.3(CC) RN4.3
SWITCH_ROW3: IC1.2(D:O) ; also sheet 1
SWITCH_ROW3_PWR: D7.3(CC) D8.3(CC) RN4.4
Unconnected: IC1.4(E:O) IC1.6(F:O)

### Notes on the sheet
- EEE-1EA100WR
- BZT52C3V0-FDICT-ND

## Library data of the parts
3V3 5V 12V 50V LED1-LED8 LED13 LED14 = led:LED: LED OSRAM: - CHIPLED LG R971, LG N971, LY N971, LG Q971, LY Q971, LO R971, LY R971 LH N974, LH R974 LS Q976, LO Q976, LY Q976 LO Q996 - Hyper CHIPLED LW Q18S LB Q993, LB Q99A, LB R99A - SideLED LS A670, LO A670, LY A670, LG A670, LP A670 LB A673, LV A673, LT A673, LW A673 LH A674 LY A675 LS A676, LA A676, LO A676, LY A676, LW A676 LS A679, LY A679, LG A679 - Hyper Micro SIDELED® LS Y876, LA Y876, LO Y876, LY Y876 LT Y87S - SmartLED LW L88C, LW L88S LB L89C, LB L89S, LG L890 LS L89K, LO L89K, LY L89K LS L896, LA L896, LO L896, LY L896 - TOPLED LS T670, LO T670, LY T670, LG T670, LP T670 LSG T670, LSP T670, LSY T670, LOP T670, LYG T670 LG T671, LOG T671, LSG T671 LB T673, LV T673, LT T673, LW T673 LH T674 LS T676, LA T676, LO T676, LY T676, LB T676, LH T676, LSB T676, LW T676 LB T67C, LV T67C, LT T67C, LS T67K, LO T67K, LY T67K, LW E67C LS E67B, LA E67B, LO E67B, LY E67B, LB E67C, LV E67C, LT E67C LW T67C LS T679, LY T679, LG T679 LS T770, LO T770, LY T770, LG T770, LP T770 LB T773, LV T773, LT T773, LW T773 LH T774 LS E675, LA E675, LY E675, LS T675 LS T776, LA T776, LO T776, LY T776, LB T776 LHGB T686 LT T68C, LB T68C - Hyper Mini TOPLED® LB M676 - Mini TOPLED Santana® LG M470 LS M47K, LO M47K, LY M47K Source: http://www.osram.convergy.de LUXEON: - LUMILED® LXK2-PW12-R00, LXK2-PW12-S00, LXK2-PW14-U00, LXK2-PW14-V00 LXK2-PM12-R00, LXK2-PM12-S00, LXK2-PM14-U00 LXK2-PE12-Q00, LXK2-PE12-R00, LXK2-PE12-S00, LXK2-PE14-T00, LXK2-PE14-U00 LXK2-PB12-K00, LXK2-PB12-L00, LXK2-PB12-M00, LXK2-PB14-N00, LXK2-PB14-P00, LXK2-PB14-Q00 LXK2-PR12-L00, LXK2-PR12-M00, LXK2-PR14-Q00, LXK2-PR14-R00 LXK2-PD12-Q00, LXK2-PD12-R00, LXK2-PD12-S00 LXK2-PH12-R00, LXK2-PH12-S00 LXK2-PL12-P00, LXK2-PL12-Q00, LXK2-PL12-R00 Source: www.luxeon.com KINGBRIGHT: KA-3528ASYC Source: www.kingbright.com
C1-C34 = rcl:C-US: CAPACITOR, American symbol
C35-C37 = rcl:CPOL-US: POLARIZED CAPACITOR, American symbol
D1-D8 = diode:BAT54C: Schottky Diodes Source: Fairchild .. BAT54.pdf
D9-D12 D37 D38 = diode:ZENER-DIODE: Z-Diode
D13-D36 = SparkFun:DIODE: Diode These are standard reverse protection diodes and small signal diodes. SMA package can handle up to about 1A. SOD-323 can handle about 200mA. What the SOD-323 package when ordering, there are some mfgs out there that are 5-pin packages.
F1 F2 = SparkFun:FUSE
H1-H4 = holes:MOUNT-HOLE: MOUNTING HOLE with drill center marker
I2C = con-molex:22-23-2041: .100" (2.54mm) Center Header - 4 Pin; MF: MOLEX; MPN: 22-23-2041; OC_FARNELL: 1462920; OC_NEWARK: 38C0355
IC1 = 74xx-us:74*14: Hex schmitt trigger INVERTER
IC2 IC3 = PowerBoard:MAX9938: MAX9938 Maxim 1μA, 4-Bump UCSP/SOT23, Precision Current-Sense Amplifier Source: http://datasheets.maxim-ic.com/en/ds/MAX9938.pdf
IC4 = rbg-richtek-vreg:RT7247A
IC5 = v-reg-3:LM1117
IC6 = rbg-ti-currentsense:LMP8480
IC7 = linear:MCP601: Single Op Amp 2.7V to 6.0V Single Supply CMOS Source: http://ww1.microchip.com/downloads/en/DeviceDoc/21314g.pdf
IC8 = 74xx-us:74*595: 8-bit SHIFT REGISTER, output latch
IC9 IC10 = 74xx-us:74*165: 8-bit parallel load SHIFT REGISTER
IC11 = lpc1100v1.1:LPC11C22/24-LQFP48: NXP Semiconductors LPC11Cxx microcontrollers <http://ics.nxp.com/products/lpc1000/lpc11xx/lpc11cxx/> ARM 32-bit Cortex-M0 Microcontroller with MPU CPU clock up to 50MHz 32KByte on-chip Flash ROM with In-System Programming (ISP) and In-Application Programming (IAP) via On-Chip Bootloader 8KByte SRAM Nested Vectored Interrupt Controller 2 SPI controllers CAN controller On-chip, high-speed CAN transciever UART with full Modem Interface and RS485 Support Fast Mode I2C-Bus 4 Timers with 4 capture channels and 12 output channels Watchdog (WDT) Sytem tick timer 10-bit ADC with 8 channels Power Management Unit (PMU) Brownout detection 12MHz internal RC oscillator Serial Wire Debug/Trace port
JTAG1 = microbuilder:JTAG-CORTEXM3: Serial Wire (SW-DP) Connector This standard 0.05" 10-pin connector is for use with the Cortex M0/M3's native SWD (serial wire debugger) interface (SW-DP). Some boards support a 20-pin combined JTAG+SWD connector (SWJ-DP), such as the LPC1700 family, but many smaller devices only work with SWD which typically use the smaller 10-pin SW-DP connecter (the LPC1300 family, for example, only supports SWD). 2x05 1.27mm/0.05" Connector: This is the standard SMT connector defined by ARM for all Cortex devices, and should be used in most situations and for forward-compatibility since any new devices coming to market will likely use this connector. MOLEX 10 Pin 0.1" Connector: This 0.1" 10 pin connector has the same pin layout as the standard 0.05" connector, but is easier to work with if you are using standard jumper wires or custom cables to connect your SWD hardware. MOLEX 20 Pin 0.1" Connector: This 0.1" 20 pin connector is the same model used for ARM7/ARM9 JTAG debuggers, but is connected to match the pins on the Segger J-Link for ARM (which supports both JTAG and SWD debugging). See the following document from ARM for more information on Cortex M3 Debug Connectors: http://infocenter.arm.com/help/topic/com.arm.doc.faqs/attached/13634/cortex_debug_connectors.pdf And the following page for an overview with images of the different connector types: http://www.keil.com/peripherals/coresight/connectors.asp
JTAG2 = rbg-generic-headers:M09-100MIL
L1 = inductors:DR1030: DR1030 Series Low Profile Power Inductors Source: Data sheet <http://www.cooperbussmann.com/pdf/c73e479f-f867-4c64-ae26-9c1f23814163.pdf>
LMP1 LMP2 = con-molex-2:555X-16: Mini FIT connector 16 way
Q1 = crystal:CRYSTAL: CRYSTAL; OC_FARNELL: unknown; OC_NEWARK: unknown
QQ1 QQ2 QQ5-QQ8 = transistors:IRF8910: International Rectifier IRF8910, 9910 Dual MOSFET in SO-8, standard pinout
QQ3 QQ4 = transistors:IRF9362
R1-R58 = rcl:R-US_: RESISTOR, American symbol
RN1-RN19 = resistor-dil:4R-N: Array Chip Resistor Source: RS Component / Phycomp; OC_FARNELL: unknown; OC_NEWARK: unknown
S1 S2 = switch-dil:DS08: DIL/CODE SWITCH; MPN: DS08; OC_FARNELL: unknown; OC_NEWARK: 73J0071
SOL1 SOL2 = con-molex-2:555X-8: Mini FIT connector 8 way
SW1-SW4 = con-molex:22-23-2081: .100" (2.54mm) Center Header - 8 Pin; MF: MOLEX; MPN: 22-23-2081; OC_FARNELL: 1756826; OC_NEWARK: 01C7592
T1-T20 = transistor:*-NPN-: NPN Transistror BF959 corrected 2008.03.06
U$3 = mi-urlogo:UR_LOGO
UART = rbg-ftdi-usb:TTL-232R-5V
X5 = con-molex:43160-*05: SDA-43160 Connector Source: http://www.molex.com/pdm_docs/sd/431601306_sd.pdf; MF: WALDOM/MOLEX; MPN: 43160-3105; OC_FARNELL: unknown; OC_NEWARK: 54H0267

## Net classes
1 HV: clearance 0.406 mm